# EAGLE design SeguidorC1.0 (EAGLE 9.6.2)
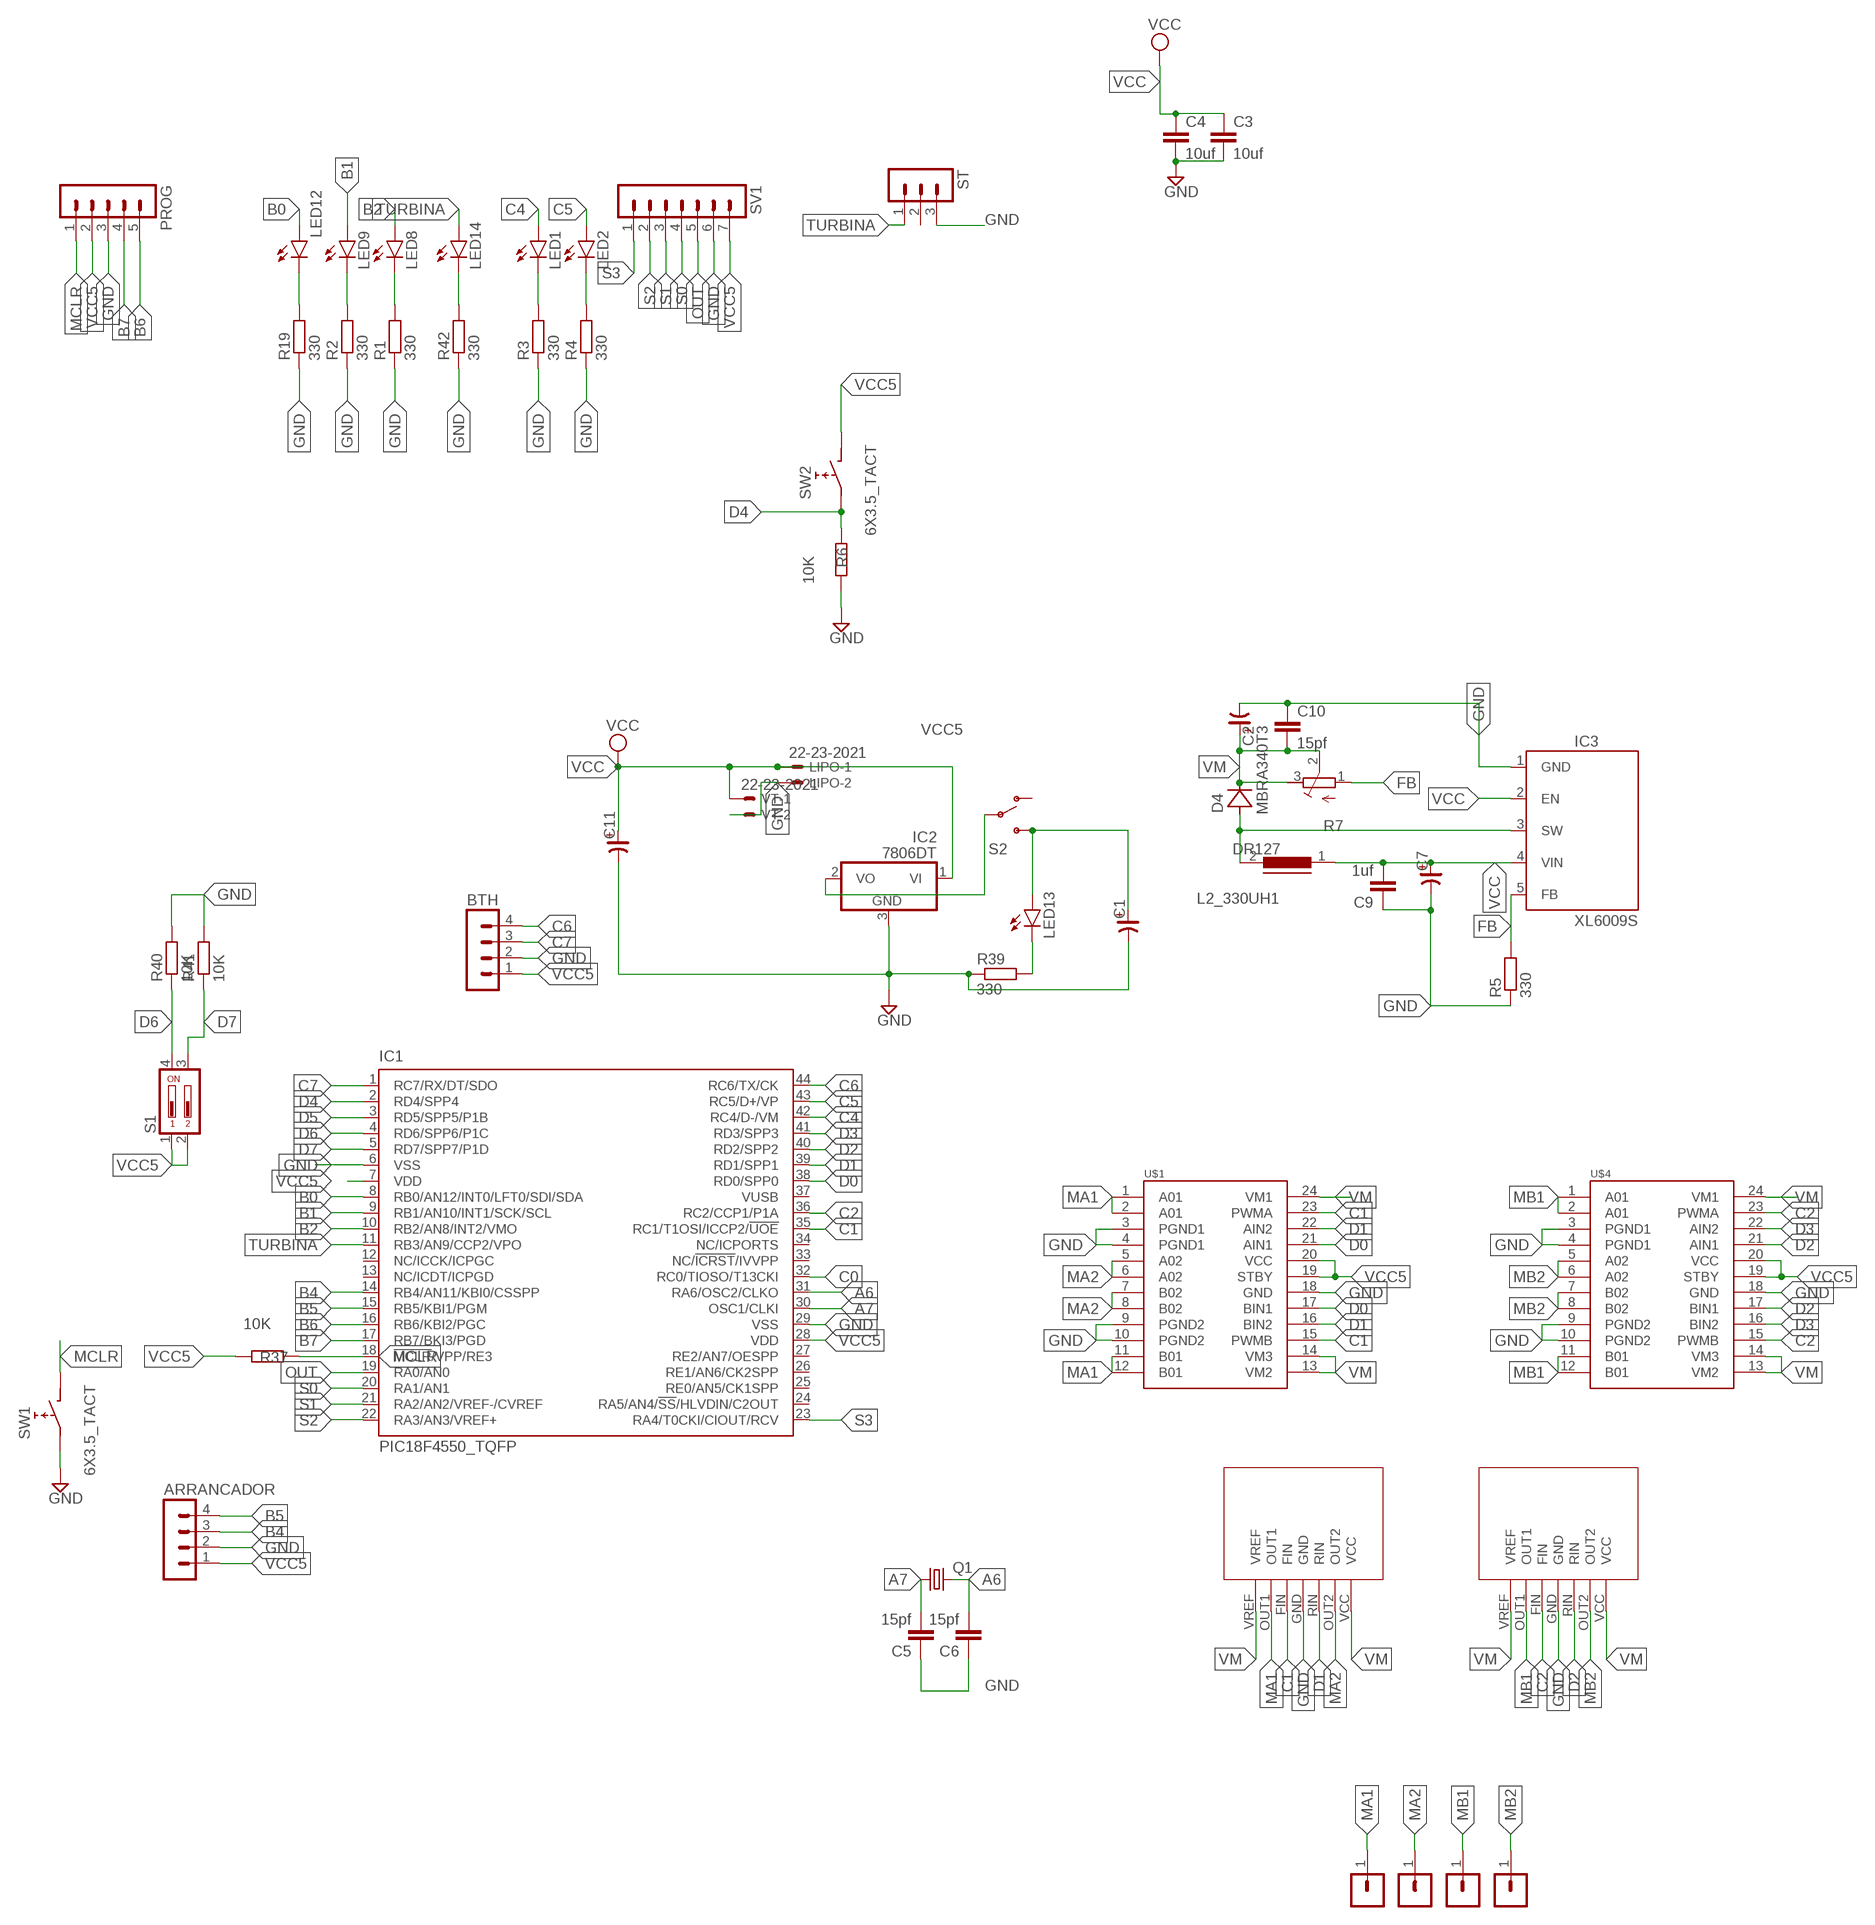
[diagram p0: schematic, sheet 1]

## Parts
ARRANCADOR  MA04-1  [MA04-1]
BTH  MA04-1  [MA04-1]
C1  CP_SV-D  [CSV-D]
C2  CP_SV-D  [CSV-D]
C3  10uf  C-EUC0805  [C0805]
C4  10uf  C-EUC0805  [C0805]
C5  15pf  C-EUC0805  [C0805]
C6  15pf  C-EUC0805  [C0805]
C7  CP_SV-D  [CSV-D]
C9  1uf  C-EUC0805  [C0805]
C10  15pf  C-EUC0805  [C0805]
C11  CP_SV-D  [CSV-D]
D4  MBRA340T3  [SMA]
IC1  PIC18F4550_TQFP  [TQFP44]
IC2  7806DT  [TO252]
IC3  XL6009S  [TO263-5]
L2_330UH1  DR127  [DR127]
LED1  LEDCHIP-LED0805  [CHIP-LED0805]
LED2  LEDCHIP-LED0805  [CHIP-LED0805]
LED8  LEDCHIP-LED0805  [CHIP-LED0805]
LED9  LEDCHIP-LED0805  [CHIP-LED0805]
LED12  LEDCHIP-LED0805  [CHIP-LED0805]
LED13  LEDCHIP-LED0805  [CHIP-LED0805]
LED14  LEDCHIP-LED0805  [CHIP-LED0805]
LIPO  22-23-2021  [22-23-2021]
PROG  MA05-1  [MA05-1]
Q1  CRYSTALHC49U-V  [HC49U-V]
R1  330  R-EU_R0805  [R0805]
R2  330  R-EU_R0805  [R0805]
R3  330  R-EU_R0805  [R0805]
R4  330  R-EU_R0805  [R0805]
R5  330  R-EU_R0805  [R0805]
R6  10K  R-EU_R0805W  [R0805W]
R7  R-TRIMM3296W  [RTRIM3296W]
R19  330  R-EU_R0805  [R0805]
R37  10K  R-EU_R0805W  [R0805W]
R39  330  R-EU_R0805  [R0805]
R40  10K  R-EU_R0805W  [R0805W]
R41  10K  R-EU_R0805W  [R0805W]
R42  330  R-EU_R0805  [R0805]
S1  DIP02YL  [DIP02YL]
S2  SWITCH-SPSTPTH  [SWITCH-SPDT]
ST  MA03-1  [MA03-1]
SV1  MA07-1  [MA07-1]
SV3  MA01-1  [MA01-1]
SV4  MA01-1  [MA01-1]
SV5  MA01-1  [MA01-1]
SV6  MA01-1  [MA01-1]
SW1  6X3.5_TACT  [TACT_6X3.5]
SW2  6X3.5_TACT  [TACT_6X3.5]
U$1  TB6621FNG  [SSOP24]
U$2  BD623XXX  [HRP7]
U$3  BD623XXX  [HRP7]
U$4  TB6621FNG  [SSOP24]
VT  22-23-2021  [22-23-2021]

## Nets
A6: C6.2 IC1.31(RA6/OSC2/CLKO) Q1.2
A7: C5.2 IC1.30(OSC1/CLKI) Q1.1
B0: IC1.8(RB0/AN12/INT0/LFT0/SDI/SDA) LED12.A
B1: IC1.9(RB1/AN10/INT1/SCK/SCL) LED9.A
B2: IC1.10(RB2/AN8/INT2/VMO) LED8.A
B4: ARRANCADOR.3 IC1.14(RB4/AN11/KBI0/CSSPP)
B5: ARRANCADOR.4 IC1.15(RB5/KBI1/PGM)
B6: IC1.16(RB6/KBI2/PGC) PROG.5
B7: IC1.17(RB7/BKI3/PGD) PROG.4
C0: IC1.32(RC0/TIOSO/T13CKI)
C1: IC1.35(RC1/T1OSI/ICCP2/!UOE) U$1.15(PWMB) U$1.23(PWMA) U$2.FIN
C2: IC1.36(RC2/CCP1/P1A) U$3.FIN U$4.15(PWMB) U$4.23(PWMA)
C4: IC1.42(RC4/D-/VM) LED1.A
C5: IC1.43(RC5/D+/VP) LED2.A
C6: BTH.4 IC1.44(RC6/TX/CK)
C7: BTH.3 IC1.1(RC7/RX/DT/SDO)
D0: IC1.38(RD0/SPP0) U$1.17(BIN1) U$1.21(AIN1)
D1: IC1.39(RD1/SPP1) U$1.16(BIN2) U$1.22(AIN2) U$2.RIN
D2: IC1.40(RD2/SPP2) U$3.RIN U$4.17(BIN1) U$4.21(AIN1)
D3: IC1.41(RD3/SPP3) U$4.16(BIN2) U$4.22(AIN2)
D4: IC1.2(RD4/SPP4) R6.2 SW2.P$1
D5: IC1.3(RD5/SPP5/P1B)
D6: IC1.4(RD6/SPP6/P1C) R40.1 S1.4
D7: IC1.5(RD7/SPP7/P1D) R41.1 S1.3
FB: IC3.5(FB) R5.2 R7.1(A)
GND: ARRANCADOR.2 BTH.2 C1.- C2.- C3.2 C4.2 C5.1 C6.1 C7.- C9.1 C10.1 C11.- IC1.6(VSS) IC1.29(VSS) IC2.3(GND) IC3.1(GND) LIPO.2 PROG.3 R1.1 R2.1 R3.1 R4.1 R5.1 R6.1 R19.1 R39.1 R40.2 R41.2 R42.1 ST.3 SV1.6 SW1.P$1 U$1.3(PGND1) U$1.4(PGND1) U$1.9(PGND2) U$1.10(PGND2) U$1.18(GND) U$2.GND U$3.GND U$4.3(PGND1) U$4.4(PGND1) U$4.9(PGND2) U$4.10(PGND2) U$4.18(GND) VT.2
MA1: SV3.1 U$1.1(A01) U$1.2(A01) U$1.11(B01) U$1.12(B01) U$2.OUT1
MA2: SV4.1 U$1.5(A02) U$1.6(A02) U$1.7(B02) U$1.8(B02) U$2.OUT2
MB1: SV5.1 U$3.OUT1 U$4.1(A01) U$4.2(A01) U$4.11(B01) U$4.12(B01)
MB2: SV6.1 U$3.OUT2 U$4.5(A02) U$4.6(A02) U$4.7(B02) U$4.8(B02)
MCLR: IC1.18(!MCLR!/VPP/RE3) PROG.1 R37.2 SW1.P$2
N$1: IC2.2(VO) S2.2(P)
N$2: LED8.C R1.2
N$3: LED9.C R2.2
N$4: LED1.C R3.2
N$5: LED2.C R4.2
N$8: D4.A IC3.3(SW) L2_330UH1.2
N$16: LED12.C R19.2
N$25: LED13.C R39.2
N$33: LED14.C R42.2
OUT: IC1.19(RA0/AN0) SV1.5
S0: IC1.20(RA1/AN1) SV1.4
S1: IC1.21(RA2/AN2/VREF-/CVREF) SV1.3
S2: IC1.22(RA3/AN3/VREF+) SV1.2
S3: IC1.23(RA4/T0CKI/CIOUT/RCV) SV1.1
TURBINA: IC1.11(RB3/AN9/CCP2/VPO) LED14.A ST.1
VCC: C3.1 C4.1 C7.+ C9.2 C11.+ IC2.1(VI) IC3.2(EN) IC3.4(VIN) L2_330UH1.1 LIPO.1 VT.1
VCC5: ARRANCADOR.1 BTH.1 C1.+ IC1.7(VDD) IC1.28(VDD) LED13.A PROG.2 R37.1 S1.1 S1.2 S2.3(S) SV1.7 SW2.P$2 U$1.19(STBY) U$1.20(VCC) U$4.19(STBY) U$4.20(VCC)
VM: C2.+ C10.2 D4.C R7.2(S) R7.3(E) U$1.13(VM2) U$1.14(VM3) U$1.24(VM1) U$2.VCC U$2.VREF U$3.VCC U$3.VREF U$4.13(VM2) U$4.14(VM3) U$4.24(VM1)
Unconnected: IC1.12(NC/ICCK/ICPGC) IC1.13(NC/ICDT/ICPGD) IC1.24(RA5/AN4/!SS!/HLVDIN/C2OUT) IC1.25(RE0/AN5/CK1SPP) IC1.26(RE1/AN6/CK2SPP) IC1.27(RE2/AN7/OESPP) IC1.33(NC/!ICRST!/IVVPP) IC1.34(NC/ICPORTS) IC1.37(VUSB) S2.1(O) ST.2

## Library data of the parts
ARRANCADOR BTH = con-lstb:MA04-1: PIN HEADER
C1 C2 C7 = rc-master-smd:CP_: POLARIZED CAP
C3-C6 C9 C10 = rcl_mod:C-EU: CAPACITOR, European symbol; SPICEPREFIX: C
C11 = rc-master-smd:CP_: POLARIZED CAP; SPICEPREFIX: C
D4 = diode:MBRA340T3: Surface Mount Schottky Power Rectifier Source: http://www.onsemi.com/pub_link/Collateral/MBRA340T3-D.PDF
IC1 = microchip:PIC18F4*_TQFP: USB Microcontrollers with nanoWatt Technology High-Performance, Enhanced Flash, 28/40/44-Pin, Source: http://ww1.microchip.com/downloads/en/devicedoc/39632c.pdf; MF: MICROCHIP; MPN: PIC18F4550-I/PT; OC_FARNELL: 9321365; OC_NEWARK: 08J9633
IC2 = regulador de voltaje linear:78*: Positive VOLTAGE REGULATOR Source: http://cache.national.com/ds/LM/LM78L05.pdf http://www.fairchildsemi.com/ds/LM/LM7805.pdf
IC3 = XL6009-TO263:XL6009: XL6009. 400KHz 60V 4A Switching Current Boost / Buck-Boost / Inverting DC/DC Converter. Created By: Manash Jyoti Deka. Github: https://github.com/mjdeka
L2_330UH1 = inductors:DR127: High Power Density, High Efficiency, Shielded Inductors Source: coiltronics_dr_series.pdf; SPICEPREFIX: L
LED1 LED2 LED8 LED9 LED12-LED14 = led:LED: LED OSRAM: - CHIPLED LG R971, LG N971, LY N971, LG Q971, LY Q971, LO R971, LY R971 LH N974, LH R974 LS Q976, LO Q976, LY Q976 LO Q996 - Hyper CHIPLED LW Q18S LB Q993, LB Q99A, LB R99A - SideLED LS A670, LO A670, LY A670, LG A670, LP A670 LB A673, LV A673, LT A673, LW A673 LH A674 LY A675 LS A676, LA A676, LO A676, LY A676, LW A676 LS A679, LY A679, LG A679 - Hyper Micro SIDELED® LS Y876, LA Y876, LO Y876, LY Y876 LT Y87S - SmartLED LW L88C, LW L88S LB L89C, LB L89S, LG L890 LS L89K, LO L89K, LY L89K LS L896, LA L896, LO L896, LY L896 - TOPLED LS T670, LO T670, LY T670, LG T670, LP T670 LSG T670, LSP T670, LSY T670, LOP T670, LYG T670 LG T671, LOG T671, LSG T671 LB T673, LV T673, LT T673, LW T673 LH T674 LS T676, LA T676, LO T676, LY T676, LB T676, LH T676, LSB T676, LW T676 LB T67C, LV T67C, LT T67C, LS T67K, LO T67K, LY T67K, LW E67C LS E67B, LA E67B, LO E67B, LY E67B, LB E67C, LV E67C, LT E67C LW T67C LS T679, LY T679, LG T679 LS T770, LO T770, LY T770, LG T770, LP T770 LB T773, LV T773, LT T773, LW T773 LH T774 LS E675, LA E675, LY E675, LS T675 LS T776, LA T776, LO T776, LY T776, LB T776 LHGB T686 LT T68C, LB T68C - Hyper Mini TOPLED® LB M676 - Mini TOPLED Santana® LG M470 LS M47K, LO M47K, LY M47K Source: http://www.osram.convergy.de LUXEON: - LUMILED® LXK2-PW12-R00, LXK2-PW12-S00, LXK2-PW14-U00, LXK2-PW14-V00 LXK2-PM12-R00, LXK2-PM12-S00, LXK2-PM14-U00 LXK2-PE12-Q00, LXK2-PE12-R00, LXK2-PE12-S00, LXK2-PE14-T00, LXK2-PE14-U00 LXK2-PB12-K00, LXK2-PB12-L00, LXK2-PB12-M00, LXK2-PB14-N00, LXK2-PB14-P00, LXK2-PB14-Q00 LXK2-PR12-L00, LXK2-PR12-M00, LXK2-PR14-Q00, LXK2-PR14-R00 LXK2-PD12-Q00, LXK2-PD12-R00, LXK2-PD12-S00 LXK2-PH12-R00, LXK2-PH12-S00 LXK2-PL12-P00, LXK2-PL12-Q00, LXK2-PL12-R00 Source: www.luxeon.com KINGBRIGHT: KA-3528ASYC Source: www.kingbright.com
LIPO VT = con-molex:22-23-2021: .100" (2.54mm) Center Header - 2 Pin; MF: MOLEX; MPN: 22-23-2021; OC_FARNELL: 1462926; OC_NEWARK: 25C3832
PROG = con-lstb:MA05-1: PIN HEADER
Q1 = crystal:CRYSTAL: CRYSTAL; OC_FARNELL: 1666969; OC_NEWARK: unknown
R1-R6 R19 R37 R39-R42 = resistor:R-EU_: RESISTOR, European symbol
R7 = rcl_mod:R-TRIMM: Trimm resistor; SPICEMODEL: X; SPICEPREFIXL: POT
S1 = switch-dil:DIP02YL: DIL/CODE SWITCH; OC_FARNELL: unknown; OC_NEWARK: unknown
S2 = SparkFun:SWITCH-SPST: SPST Switch Simple slide switch. Spark Fun Electronics SKU : COM-00102
ST = con-lstb:MA03-1: PIN HEADER
SV1 = con-lstb:MA07-1: PIN HEADER
SV3-SV6 = con-lstb:MA01-1: PIN HEADER
SW1 SW2 = tactile_switch:6X3.5_TACT
U$1 U$4 = SparkFun:TB6621FNG: Toshiba 1A motor driver
U$2 U$3 = BD6232:BD623XXX

## Board
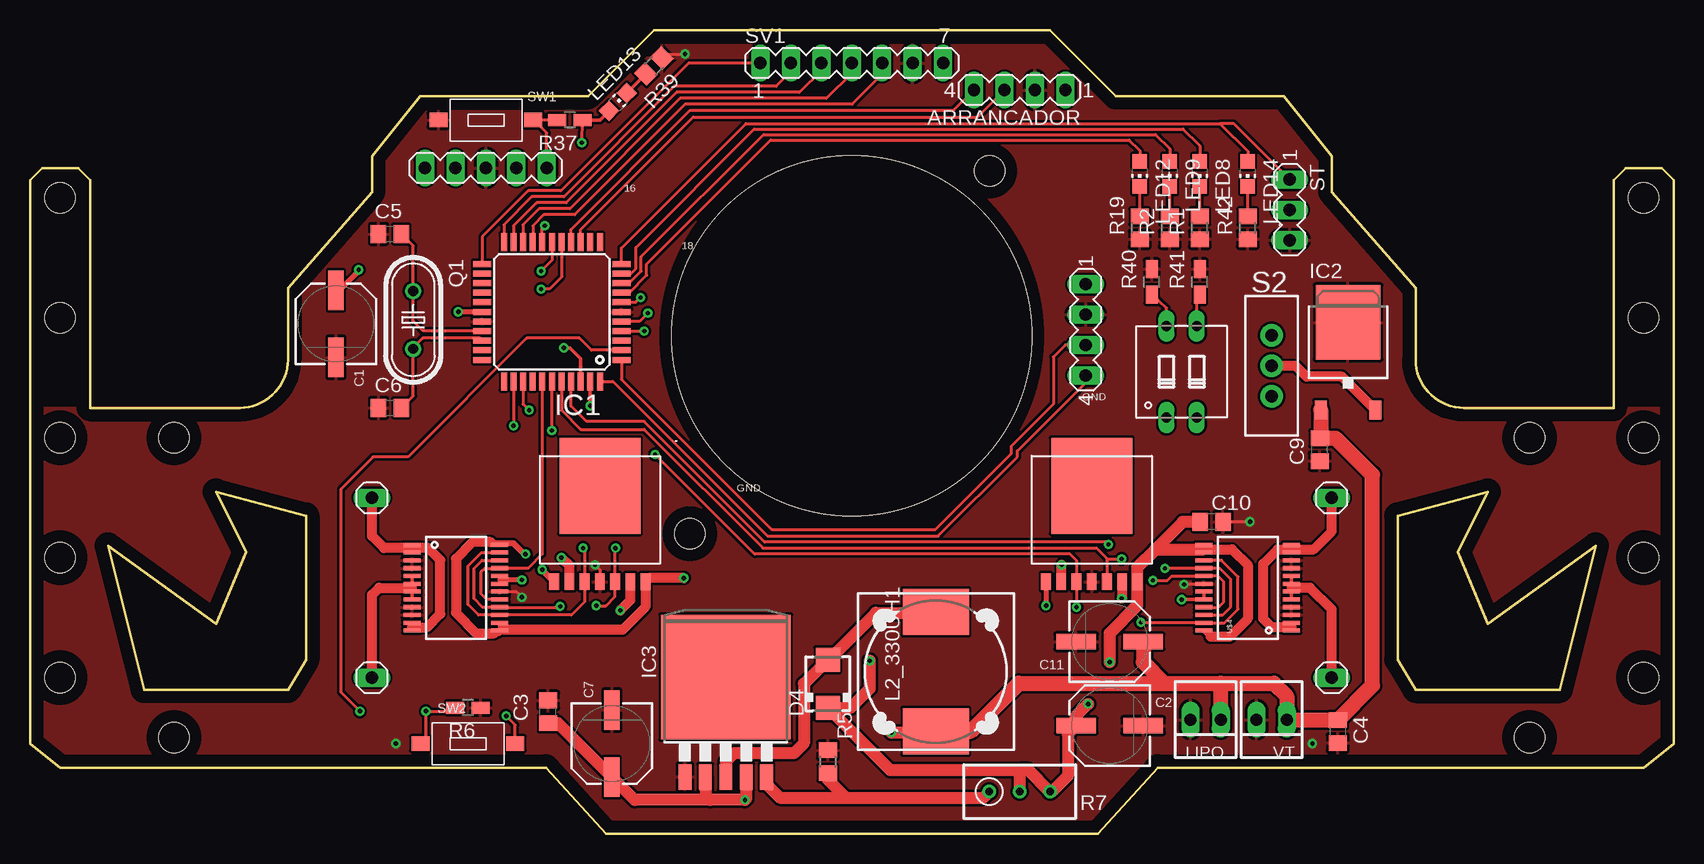
[diagram p1: board, top side]
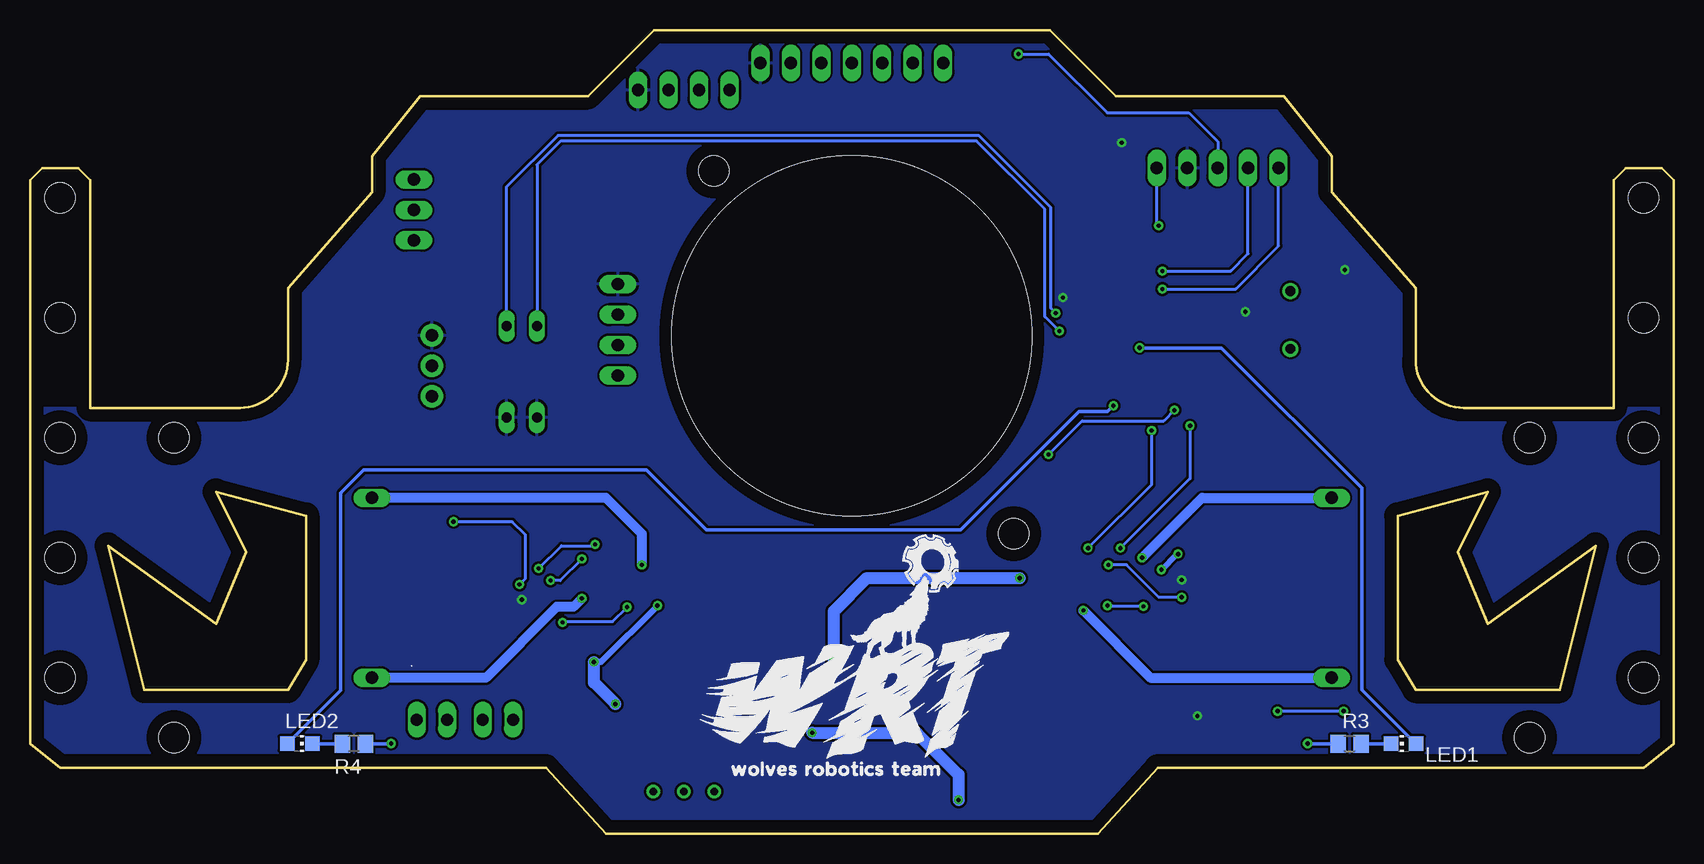
[diagram p2: board, bottom side, seen from below]

Size 137 x 67 mm. Coordinates in mm from the lower left corner, seen from the top.
Outline: 2.5,5.5 43,5.5 48,0 89,0 94,5.5 134.5,5.5 137,7.5 137,33.5 137,54.5 136,55.5 133,55.5 132,54.5 132,35.5 119.5,35.5 arc-90 115.5,39.5 115.5,45.5 108.5,53.5 108.5,56.5 104.5,61.5 90.5,61.5 85,67 52,67 46.5,61.5 32.5,61.5 28.5,56.5 28.5,53.5 21.5,45.5 21.5,39.5 arc-90 17.5,35.5 5,35.5 5,54.5 4,55.5 1,55.5 0,54.5 0,33.5 0,7.5 2.5,5.5
Outline: 18,23.5 15.5,28.5 23,26.5 23,14.5 21.5,12 9.5,12 6.5,24 15.5,17.5 18,23.5
Outline: 119,23.5 121.5,28.5 114,26.5 114,14.5 115.5,12 127.5,12 130.5,24 121.5,17.5 119,23.5
Copper layers (1*16): Top 0.035mm / dielectric 1.5mm / Bottom 0.035mm
Design rules "default *": minimum track width 8mil, minimum drill 0.25mm, track to track 8mil, track to pad 8mil, pad to pad 8mil, via to via 8mil, smd to smd 8mil, copper to edge 40mil, drill to drill 8mil, minimum pad ring 10mil, minimum via ring 8mil, stop-mask expansion 4mil, vias tented up to drill 0mil, thermal gap 10mil
Holes 30 mm at 68.5,41.5
Holes 2.5 mm at 12,33 12,8 125,33 125,8 2.5,33 2.5,23 2.5,13 2.5,43 2.5,53 134.5,13 134.5,23 134.5,33 134.5,43 134.5,53 80,55.25 55,25

### Footprints (pad centres in the part's own frame; a part is rotated, then mirrored left to right if it is on the bottom)
MA04-1 = drill 1.016 long: 1 -3.81,0; 2 -1.27,0; 3 1.27,0; 4 3.81,0
CSV-D = smd 3.302 x 1.27: + -2.794,0; - 2.794,0
C0805 = smd 1.3 x 1.5: 1 -0.95,0; 2 0.95,0
SMA = smd 2 x 2: A 2,0; C -2,0
TQFP44 = smd 1.5 x 0.5: 1 -5.8,4; 2 -5.8,3.2; 3 -5.8,2.4; 4 -5.8,1.6; 5 -5.8,0.8; 6 -5.8,0; 7 -5.8,-0.8; 8 -5.8,-1.6; 9 -5.8,-2.4; 10 -5.8,-3.2; 11 -5.8,-4; 23 5.8,-4; 24 5.8,-3.2; 25 5.8,-2.4; 26 5.8,-1.6; 27 5.8,-0.8; 28 5.8,0; 29 5.8,0.8; 30 5.8,1.6; 31 5.8,2.4; 32 5.8,3.2; 33 5.8,4 | smd 0.5 x 1.5: 12 -4,-5.8; 13 -3.2,-5.8; 14 -2.4,-5.8; 15 -1.6,-5.8; 16 -0.8,-5.8; 17 0,-5.8; 18 0.8,-5.8; 19 1.6,-5.8; 20 2.4,-5.8; 21 3.2,-5.8; 22 4,-5.8; 34 4,5.8; 35 3.2,5.8; 36 2.4,5.8; 37 1.6,5.8; 38 0.8,5.8; 39 0,5.8; 40 -0.8,5.8; 41 -1.6,5.8; 42 -2.4,5.8; 43 -3.2,5.8; 44 -4,5.8
TO252 = smd 1 x 1.6: 1 -2.28,-4.8; 2 2.28,-4.8 | smd 5.4 x 6.2: 3 0,2.5
TO263-5 = smd 1.067 x 2.159: 1 -3.404,-5.791; 2 -1.702,-5.791; 3 0,-5.791; 4 1.702,-5.791; 5 3.404,-5.791 | smd 10.8 x 10.41: 6 0,2.54
DR127 = smd 3.85 x 5.5: 1 -4.975,0; 2 4.975,0
CHIP-LED0805 = smd 1.2 x 1.2: A 0,-1.05; C 0,1.05
22-23-2021 = drill 1 long: 1 -1.27,0; 2 1.27,0
MA05-1 = drill 1.016 long: 1 -5.08,0; 2 -2.54,0; 3 0,0; 4 2.54,0; 5 5.08,0
HC49U-V = drill 0.813: 1 -2.413,0; 2 2.413,0
R0805 = smd 1.3 x 1.5: 1 -0.95,0; 2 0.95,0
R0805W = smd 1.5 x 1: 1 -1.052,0; 2 1.052,0
RTRIM3296W = drill 0.61: 1 0,-2.54; 2 0,0; 3 0,2.54
DIP02YL = drill 0.813 long: 1 -1.27,-3.81; 2 1.27,-3.81; 3 1.27,3.81; 4 -1.27,3.81
SWITCH-SPDT = drill 1.016 pad 1.88: 1 0,2.54; 2 0,0; 3 0,-2.54
MA03-1 = drill 1.016 long: 1 -2.54,0; 2 0,0; 3 2.54,0
MA07-1 = drill 1.016 long: 1 -7.62,0; 2 -5.08,0; 3 -2.54,0; 4 0,0; 5 2.54,0; 6 5.08,0; 7 7.62,0
MA01-1 = drill 1.016 long: 1 0,0
TACT_6X3.5 = smd 1.5 x 1.2: P$1 -3.95,0; P$2 3.95,0
SSOP24 = smd 0.348 x 1.397: 1 -3.575,-3.656; 2 -2.925,-3.656; 3 -2.275,-3.656; 4 -1.625,-3.656; 5 -0.975,-3.656; 6 -0.325,-3.656; 7 0.325,-3.656; 8 0.975,-3.656; 9 1.625,-3.656; 10 2.275,-3.656; 11 2.925,-3.656; 12 3.575,-3.656; 13 3.575,3.656; 14 2.925,3.656; 15 2.275,3.656; 16 1.625,3.656; 17 0.975,3.656; 18 0.325,3.656; 19 -0.325,3.656; 20 -0.975,3.656; 21 -1.625,3.656; 22 -2.275,3.656; 23 -2.925,3.656; 24 -3.575,3.656
HRP7 = smd 0.8 x 1.4: FIN -1.27,-6.5; GND 0,-6.5; OUT1 -2.54,-6.5; OUT2 2.54,-6.5; RIN 1.27,-6.5; VCC 3.81,-6.5; VREF -3.81,-6.5 | smd 6.75 x 8: P$8 0,1.5

### Placement (x,y rotation side)
ARRANCADOR  82.5,62 180 top
BTH  88,42 270 top
C1  25.5,42.5 270 top
C2  90,9 0 top
C3  43.2,10.15 90 top
C4  109,8.5 270 top
C5  30,50 0 top
C6  30,35.5 0 top
C7  48.5,7.5 90 top
C9  107.5,32 90 top
C10  98.5,26 180 top
C11  90,16 180 top
D4  66.5,12.5 90 top
IC1  43.5,43.5 180 top
IC2  109.87,40.12 0 top
IC3  58,10.5 0 top
L2_330UH1  75.5,13.5 90 top
LED1  22.5,7.5 90 bottom
LED2  114.5,7.5 270 bottom
LED8  97.5,55 180 top
LED9  95,55 180 top
LED12  92.5,55 180 top
LED13  49,61 315 top
LED14  101.5,55 180 top
LIPO  98,9.5 180 top
PROG  38,55.5 180 top
Q1  31.95,42.82 270 top
R1  97.5,50.5 90 top
R2  95,50.5 90 top
R3  27,7.5 0 bottom
R4  110,7.5 180 bottom
R5  66.5,6 270 top
R6  36.5,10.5 180 top
R7  82.5,3.5 270 top
R19  92.5,50.5 90 top
R37  45,59.5 180 top
R39  52,64 225 top
R40  93.5,46 90 top
R41  97.5,46 90 top
R42  101.5,50.5 90 top
S1  96,38.5 0 top
S2  103.5,39 180 top
ST  105,52 270 top
SV1  68.5,64.25 0 top
SV3  28.5,28 90 top
SV4  28.5,13 90 top
SV5  108.5,28 90 top
SV6  108.5,13 90 top
SW1  38,59.5 0 top
SW2  36.5,7.5 0 top
U$1  35.5,20.5 270 top
U$2  47.5,27.5 0 top
U$3  88.5,27.5 0 top
U$4  101.5,20.5 90 top
VT  103.5,9.5 180 top

### Tracks (layer width: path | path; a pad name or v marks a point on that pad's centre or on a via)
A6
  Top 0.254: C6.2 31.95,36.5 Q1.2 31.95,40.51 32.74,41.3 37.5,41.3 IC1.31
A7
  Top 0.254: C5.2 31.95,49 Q1.1 31.95,42.73 32.78,41.9 IC1.30
B0
  Top 0.254: IC1.8 49.32,45.12 49.99,45.12 51.41,46.55 51.41,47.5 61.75,57.83 91.62,57.83 92.5,56.95 LED12.A
B1
  Top 0.254: IC1.9 49.5,45.9 49.52,45.92 49.99,45.92 50.96,46.89 50.96,48.08 61.16,58.29 93.81,58.29 95,57.1 LED9.A
B2
  Top 0.254: IC1.10 50.1,46.7 50.5,47.1 50.5,48.87 60.37,58.74 96.11,58.74 97.5,57.35 LED8.A
B4
  Top 0.254: ARRANCADOR.3 78.98,59.75 55.28,59.75 45.9,50.37 IC1.14
B5
  Top 0.254: ARRANCADOR.4 76.99,60.3 55.03,60.3 45.1,50.37 IC1.15
B6  (via drill 0.35)
  Top 0.254: IC1.16 44.3,46.4 43.3,45.4 v42.6,45.4
  Bottom 0.254: v42.6,45.4 36.5,45.4 32.92,48.98 PROG.5
B7  (via drill 0.35)
  Top 0.254: IC1.17 43.5,47.8 v42.6,46.9
  Bottom 0.254: PROG.4 35.46,48.34 36.9,46.9 v42.6,46.9
C1  (via drill 0.35)
  Top 0.254: IC1.35 v40.3,34 | v46.1,23.8 46.23,23.67 U$2.FIN 46.23,19.33 45.12,18.23 U$1.15 37.38,18.23 36.5,19.1 36.5,22.3 37.62,23.42 U$1.23
  Bottom 0.254: v40.3,34 40.3,29.6 v46.1,23.8
C2  (via drill 0.35)
  Top 0.254: IC1.36 41.1,35.8 v41.6,35.3 | v52.1,31.6 60.4,23.3 86.7,23.3 87.23,22.77 U$3.FIN v87.23,18.88 v87.22,18.88 | U$4.15 99.33,22.77 100.7,21.4 100.7,18.7 99.58,17.58 U$4.23 97.82,17.6 v92.6,17.6
  Bottom 0.254: v41.6,35.3 42.5,34.4 49.3,34.4 v52.1,31.6 | v92.6,17.6 92.53,17.67 88.42,17.67 v87.22,18.88
C4  (via drill 0.35)
  Top 0.305: IC1.42 45.9,39.6 45,40.5 v44.5,40.5
  Bottom 0.305: v44.5,40.5 37.7,40.5 26,28.8 26,12 21.5,7.5 LED1.A
C5  (via drill 0.35)
  Top 0.305: IC1.43 v46.7,35.67
  Bottom 0.305: v46.7,35.67 47.18,35.18 49.55,35.18 59.44,25.3 80.6,25.3 85.6,30.3 109.2,30.3 111.1,28.4 111.1,11.95 LED2.A
C6
  Top 0.254: IC1.44 48.59,37.7 61.49,24.8 75.7,24.8 82.3,31.4 82.3,31.9 88,37.6 BTH.4
C7
  Top 0.254: IC1.1 49.3,37.87 61.81,25.36 75.49,25.36 81.8,31.67 81.8,32.3 85.3,35.8 85.3,39.73 86.3,40.73 BTH.3
D0
  Top 0.254: IC1.38 42.7,23.3 41.52,22.12 U$1.21 37.92,22.12 37.6,21.8 37.6,20 38.08,19.52 U$1.17
D1  (via drill 0.35)
  Top 0.254: v44.2,18.93 44.14,18.88 U$1.16 37.73,18.88 37,19.6 37,22.1 37.67,22.77 U$1.22 | v47.2,19 48,19 48.77,19.77 U$2.RIN 48.77,23.77 v48.8,23.8 | v43.5,33.6 IC1.39
  Bottom 0.254: v44.2,18.93 47.13,18.93 v47.2,19 | v48.8,23.8 43.5,29.1 v43.5,33.6
D2  (via drill 0.35)
  Top 0.254: U$4.21 99.08,18.88 99.5,19.3 99.5,21 99.03,21.48 U$4.17 95.17,21.48 94.8,21.1 v93.6,21.1 | IC1.40 44.3,35.3 45.9,33.7 51.2,33.7 61.1,23.8 88.9,23.8 89.77,22.93 | 89.77,22.93 U$3.RIN | 89.77,22.93 89.8,22.9 v91,22.9
  Bottom 0.254: v91,22.9 92.8,21.1 v93.6,21.1
D3  (via drill 0.35)
  Top 0.254: U$4.22 99.42,18.23 100.1,18.9 100.1,21.2 99.17,22.12 U$4.16 97.82,22.1 v94.6,22.1 | v89.9,24.1 89.7,24.3 61.25,24.3 51.19,34.36 46.38,34.36 45.1,35.63 IC1.41
  Bottom 0.254: v89.9,24.1 90,24 92.7,24 v94.6,22.1
D4  (via drill 0.35)
  Top 0.254: IC1.2 46.8,40.3 45.8,41.3 41.4,41.3 31.5,31.4 28.6,31.4 25.9,28.7 25.9,11.8 v27.5,10.2 | R6.2 35.15,10.2 v33,10.2 33,7.95 SW2.P$1
  Bottom 0.254: v27.5,10.2 v33,10.2
D6  (via drill 0.35)
  Top 0.254: IC1.4 v51.2,41.9 | S1.4 94.73,43.82 R40.1
  Bottom 0.254: v51.2,41.9 52.4,43.1 52.4,52.05 58.09,57.74 92.76,57.74 94.73,55.77 S1.4
D7  (via drill 0.35)
  Top 0.254: v51.5,43.4 50.8,42.7 IC1.5 | S1.3 97.27,44.82 R41.1
  Bottom 0.254: v51.5,43.4 51.9,43.8 51.9,52.2 57.9,58.2 93,58.2 97.3,53.9 97.3,42.34 S1.3
FB
  Top 1.016: IC3.5 61.4,4.1 62.5,3 68,3 | 68,3 79.46,3 R7.1 | R5.2 66.5,4.5 68,3
GND  (via drill 0.35)
  Top 0.254: U$4.18 97.79,20.77 v96.2,20.77 | v101.7,26 C10.1 | R39.1 53,65 v54.6,65 | U$1.18 40.52,20.17 v41,19.7 | v47.1,22.4 47.5,22 U$2.GND
  Bottom 0.254: v96.2,20.77 95.7,21.27 95.7,24.9 96.8,26 v101.7,26 | v54.6,65 52.1,65 47.2,60.1 40.4,60.1 38,57.7 PROG.3 | v41,19.7 42.9,19.7 45.6,22.4 v47.1,22.4
  Bottom 0.305: R3.1 v30.5,7.5 | R4.1 v106.9,7.5
  pour Top: -1.5,35.5 -1.5,5.5 43.5,5.5 48.5,0.5 88.5,0.5 93.5,5.5 138.5,5.5 138.5,35.5 119.5,35.5 arc-90 115.5,39.5 115.5,45.5 108.5,53.5 108.5,56.5 104.5,61.5 90.5,61.5 86.5,67 50.5,67 46.5,61.5 32.5,61.5 28.5,56.5 28.5,53.5 21.5,45.5 21.5,39.5 arc-90 17.5,35.5
MA1  (via drill 0.35)
  Top 0.305: U$1.2 31.84,23.8 U$1.1 | U$1.12 31.84,17.2 U$1.11
  Top 0.813: U$2.OUT1 44.96,22.34 v44.3,23 | SV3.1 28.5,24.8 29.5,23.8 31.84,23.8 33.2,23.8 34.2,22.8 34.2,18.3 33.1,17.2 31.84,17.2
  Bottom 0.813: v44.3,23 39.3,28 SV3.1
MA2  (via drill 0.35)
  Top 0.305: U$1.5 U$1.6 31.84,20.5 U$1.7 U$1.8
  Top 0.813: U$2.OUT2 50.04,19.44 v49.2,18.6 | SV4.1 28.5,19.9 29.1,20.5 31.84,20.5
  Bottom 0.813: v49.2,18.6 43.6,13 SV4.1
MB1  (via drill 0.35)
  Top 0.305: U$4.12 105.16,23.7 U$4.11 | U$4.2 105.16,17.2 U$4.1
  Top 0.813: U$3.OUT1 85.96,22.36 v86,22.4 | SV5.1 108.5,25.2 107,23.7 105.16,23.7 104,23.7 102.8,22.5 102.8,17.9 103.5,17.2 105.16,17.2
  Bottom 0.813: v86,22.4 86,25 89,28 SV5.1
MB2  (via drill 0.35)
  Top 0.305: U$4.8 U$4.7 105.16,20.5 U$4.6 U$4.5
  Top 0.813: SV6.1 108.5,18.7 106.7,20.5 105.16,20.5 | U$3.OUT2 91.04,19.64 v91,19.6
  Bottom 0.813: v91,19.6 91.7,18.9 93.1,18.9 99,13 SV6.1
MCLR  (via drill 0.35)
  Top 0.254: IC1.18 42.7,50.47 v42.92,50.68 | R37.2 42,59.5 | 42,59.5 SW1.P$2 | PROG.1 43.08,58.42 42,59.5
  Bottom 0.254: v42.92,50.68 43.08,50.84 PROG.1
N$1
  Top 0.813: IC2.2 109.37,38.1 106.4,38.1 105.5,39 S2.2
N$2
  Top 0.254: R1.2 LED8.C
N$3
  Top 0.254: R2.2 LED9.C
N$4
  Bottom 0.305: R3.2 LED1.C
N$5
  Bottom 0.305: R4.2 LED2.C
N$8
  Top 1.016: IC3.3 58,6.01 58.69,6.7 63.67,6.7 64.5,7.53 64.5,12.5 D4.A 66.6,14.5 70.5,18.4 75.42,18.4 L2_330UH1.2
N$16
  Top 0.254: R19.2 LED12.C
N$25
  Top 0.305: LED13.C R39.2
N$33
  Top 0.254: R42.2 LED14.C
OUT
  Top 0.254: SV1.5 71.04,63.32 68.52,60.8 54.6,60.8 45.4,51.6 42.83,51.6 41.92,50.69 41.92,49.32 IC1.19
S0
  Top 0.254: SV1.4 68.5,63.42 66.38,61.3 54.2,61.3 45,52.1 42.43,52.1 41.1,50.77 IC1.20
S1
  Top 0.254: SV1.3 65.96,63.62 64.14,61.8 53.9,61.8 44.7,52.6 42.23,52.6 40.3,50.67 IC1.21
S2
  Top 0.254: SV1.2 63.42,63.52 62.2,62.3 53.7,62.3 44.5,53.1 41.83,53.1 39.5,50.77 IC1.22
S3
  Top 0.254: SV1.1 54.88,64.22 44.26,53.6 41.53,53.6 37.7,49.77 IC1.23
TURBINA
  Top 0.254: IC1.11 49.3,48.82 59.68,59.2 99.2,59.2 | 99.2,59.2 101.5,56.9 LED14.A | ST.1 100.34,59.2 99.2,59.2
VCC  (via drill 0.35)
  Top 1.016: IC3.4 59.7,2.9 v59.6,2.8 56.7,2.8 | 56.7,2.8 56.3,3.2 IC3.2 | 56.7,2.8 50.41,2.8 C7.+ 44.01,9.2 C3.1 | L2_330UH1.1 75.38,8.4 v71.8,8.4
  Top 1.27: LIPO.1 99.27,12.53 | IC2.1 107.59,33.04 C9.2 108.85,32.95 111.9,29.9 111.9,12.35 C4.1 108.95,9.5 VT.1 104.77,11.47 103.71,12.53 99.27,12.53 | 94.57,12.53 92.79,14.31 C11.+ | 94.57,12.53 99.27,12.53 | L2_330UH1.1 78.42,8.52 82.43,12.53 94.57,12.53
  Bottom 1.016: v71.8,8.4 63.1,8.4 59.6,4.9 v59.6,2.8
VCC5  (via drill 0.35)
  Top 0.254: IC1.7 50.49,44.3 v50.89,44.7 | R37.1 45.95,57.65 v46,57.6 | 40.55,7.6 SW2.P$2 40.45,9.05 v39.7,9.8
  Top 0.305: U$1.19 39.16,21.15 U$1.20 | R37.1 47.5,59.5 LED13.A | U$4.19 U$4.20 96.03,19.52 v96,19.5
  Top 0.406: IC1.28 v35.7,43.5 | C1.+ 25.8,45.29 27.4,46.89 v27.4,47 | 41.15,21 v41,21.15 39.16,21.15
  pour Bottom: 43.5,5.5 -1.5,5.5 -1.5,35.5 17.5,35.5 arc90 21.5,39.5 21.5,45.5 28.5,53.5 28.5,56.5 32.5,61.5 46.5,61.5 50.5,67 86.5,67 90.5,61.5 104.5,61.5 108.5,56.5 108.5,53.5 115.5,45.5 115.5,39.5 arc90 119.5,35.5 138.5,35.5 138.5,5.5 93.5,5.5 88.5,0.5 48.5,0.5
VM  (via drill 0.35)
  Top 0.305: 38.4,24.3 38.93,24.3 U$1.24 | U$4.13 97.84,23.7 U$4.14 | 98.4,16.4 98.27,16.4 97.84,16.83 U$4.24 | 39.16,16.7 U$1.13 U$1.14
  Top 0.406: 38.7,16.7 39.16,16.7 | 39.5,17 39.23,17 U$1.13 | U$3.VREF v84.7,19
  Top 0.508: U$2.VREF v42.69,22 v42.7,22 | v41.3,23.3 41.2,23.3 40.3,24.2 38.5,24.2 38.4,24.3
  Top 0.813: 38.4,24.3 36.9,24.3 35.5,22.9 35.5,18.4 37.2,16.7 38.7,16.7 | 97.84,23.7 100.2,23.7 101.5,22.4 101.5,17.9 100,16.4 98.4,16.4 | 39.5,17 49.4,17 51.31,18.91 U$2.VCC 51.61,21.3 v54.5,21.3
  Top 1.016: 82.5,5.3 71.7,5.3 D4.C 68.4,10.5 70,12.1 v70,14.4 | 82.5,5.3 83.24,5.3 R7.3 85.07,3.53 85.24,3.53 86.51,4.8 86.51,8.3 C2.+ 87.21,9.81 v88.2,10.8 | R7.2 82.5,5.3 | 93.8,23.7 97.84,23.7 | 93.8,23.7 92.31,22.21 U$3.VCC 92.31,19.01 90,16.7 v90,14.3 | C10.2 96.1,26 93.8,23.7
  Bottom 0.508: v42.7,22 41.4,23.3 v41.3,23.3 | v84.7,19 89.4,14.3 v90,14.3
  Bottom 1.016: v54.5,21.3 67.24,21.3 70,18.54 v70,14.4 | v88.2,10.8 90,12.6 v90,14.3

### Text on the board
tPlace: 16 | 18 | GND | GND
bPlace: -